# EAGLE design Nixie_v1_HV_Supply (EAGLE 9.3.0)
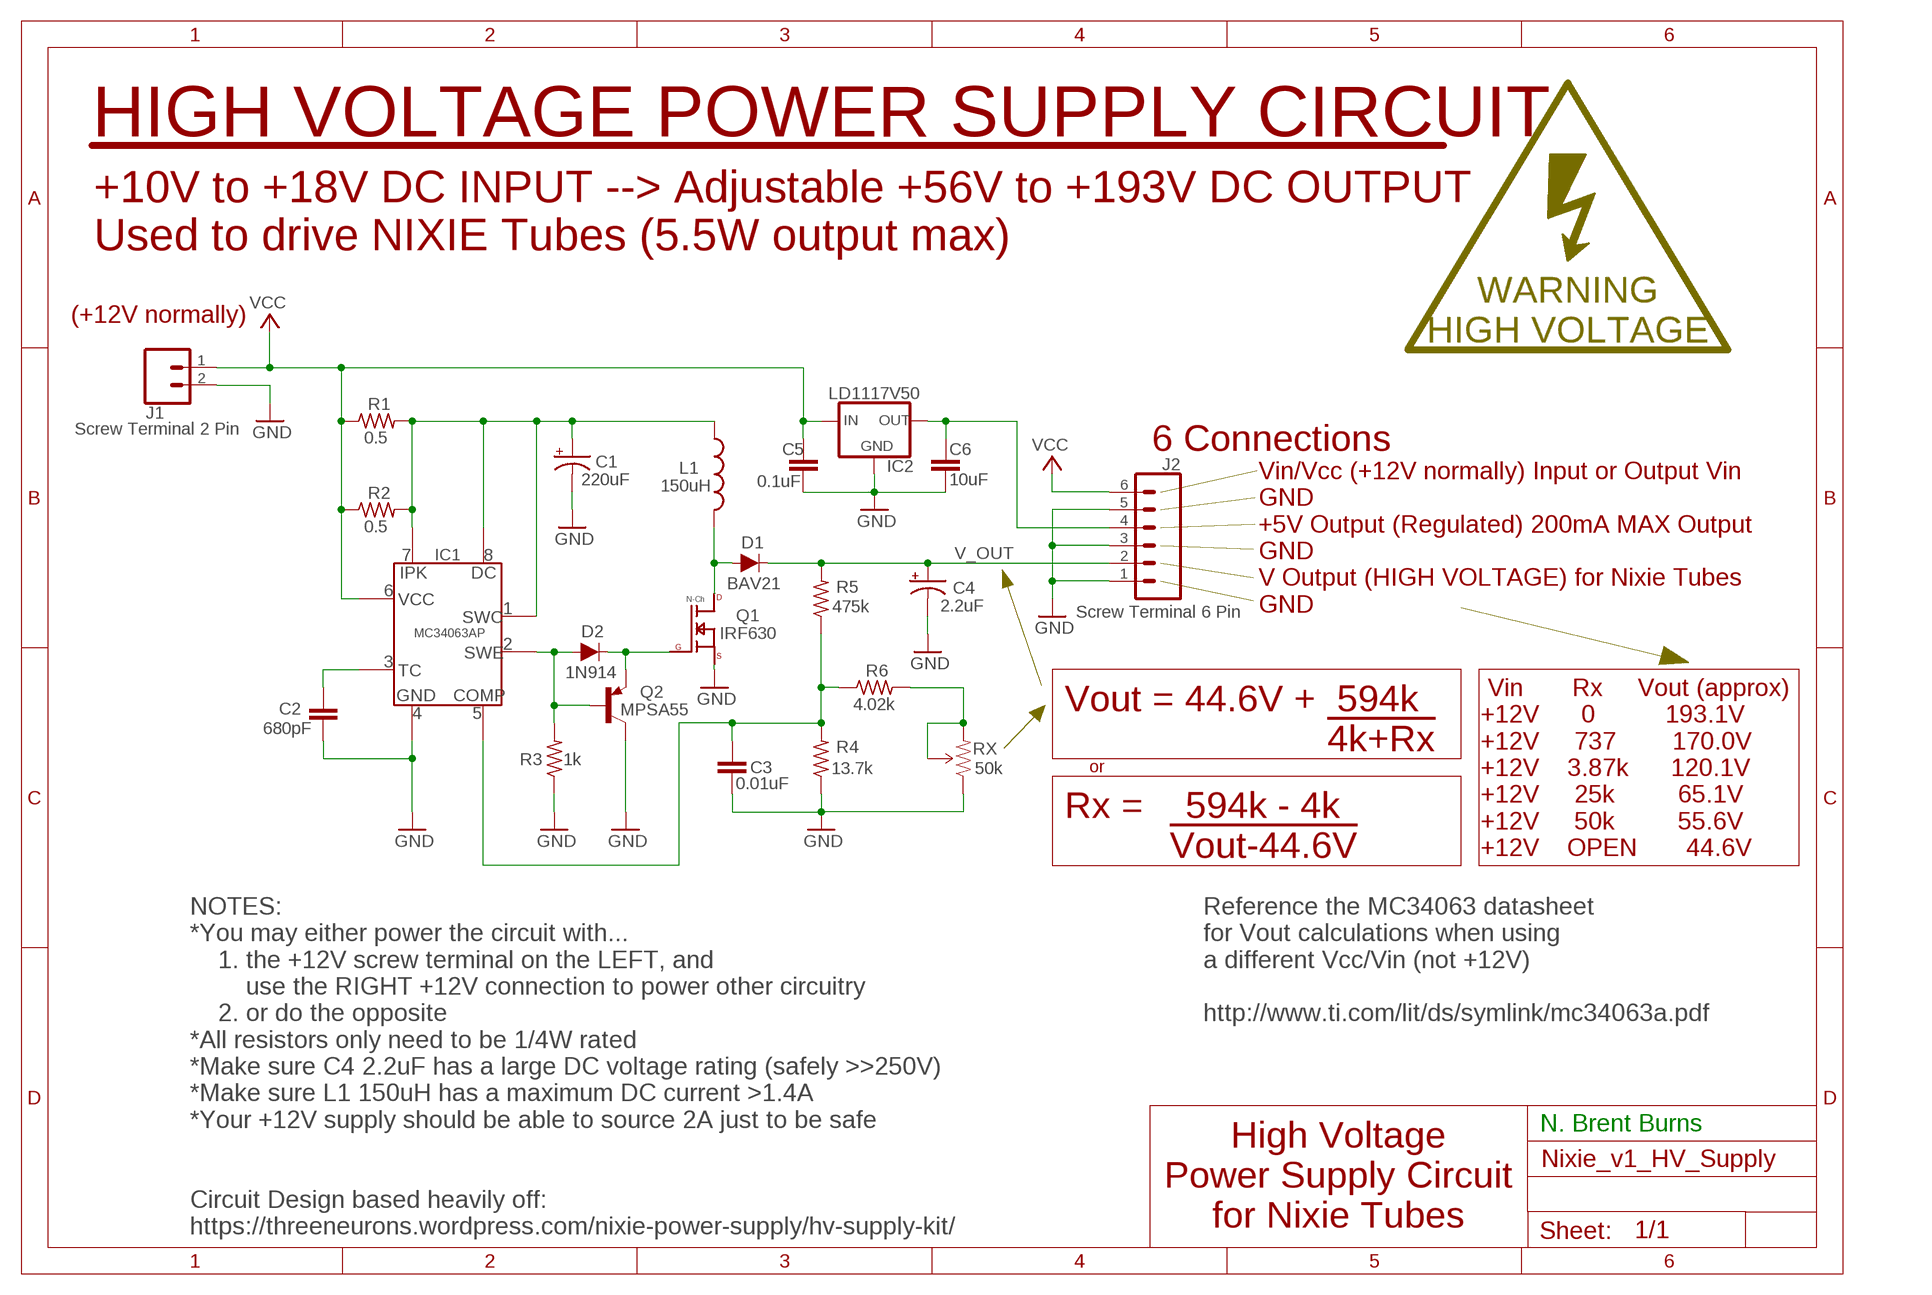
[diagram p0: schematic, sheet 1]

## Parts
C1  220uF  1000UF-RADIAL-5MM-25V-20%  [CPOL-RADIAL-5MM-10MM]
C2  680pF  C2.5/2  [C2.5-2]
C3  0.01uF  C2.5/2  [C2.5-2]
C4  2.2uF  100UF-POLAR-RADIAL-2.5MM-25V-20%  [CPOL-RADIAL-2.5MM-6.5MM]
C5  0.1uF  C2.5/2  [C2.5-2]
C6  10uF  C2.5/2  [C2.5-2]
D1  BAV21  DIODE-1N4148  [DIODE-1N4148]
D2  1N914  DIODE-1N4148  [DIODE-1N4148]
IC1  MC34063AP  [DIP08]
IC2  LD1117V50  V_REG_LD1117V50  [TO220V]
J1  Screw Terminal 2 Pin  CONNECTOR_2PINSCREW_TERMINAL_5MMPITCH_1X2  [SCREW_TERM_5MM_1X2]
J2  Screw Terminal 6 Pin  CONNECTOR_6PINSCREW_TERMINAL_5MM_PITCH  [SCREW_TERM_5MM_1X6]
L1  150uH  INDUCTOR_150UH_6100-151K-RC  [INDUCTOR_11MM_DIAM_6MM_PITCH]
Q1  IRF630  [TO220V]
Q2  MPSA55  [TO92-]
R1  0.5  R-US_0204/7  [0204/7]
R2  0.5  R-US_0204/7  [0204/7]
R3  1k  R-US_0204/7  [0204/7]
R4  13.7k  R-US_0204/7  [0204/7]
R5  475k  R-US_0204/7  [0204/7]
R6  4.02k  R-US_0204/7  [0204/7]
RX  50k  TRIMPOT  [TRIM_POT_PTH]

## Nets
GND: C1.- C2.2 C3.2 C4.2(-) C5.2 C6.2 IC1.4(GND) IC2.1(GND) J1.2 J2.1 J2.3 J2.5 Q1.3(SOURCE) Q2.3(C) R3.1 R4.1 RX.1(CCW)
N$1: C6.1 IC2.2(OUT) J2.4
N$2: D1.A L1.2 Q1.2(DRAIN)
N$3: C4.1(+) D1.C J2.2 R5.2
N$4: C2.1 IC1.3(TC)
N$5: C3.1 IC1.5(COMP) R4.2 R5.1 R6.1
N$6: C1.+ IC1.1(SWC) IC1.7(IPK) IC1.8(DC) L1.1 R1.2 R2.2
N$7: R6.2 RX.2(WIPER) RX.3(CW)
N$8: D2.A IC1.2(SWE) Q2.2(B) R3.2
N$9: D2.C Q1.1(GATE) Q2.1(E)
VCC: C5.1 IC1.6(VCC) IC2.3(IN) J1.1 J2.6 R1.1 R2.1

## Notes on the sheet
- HIGH VOLTAGE POWER SUPPLY CIRCUIT
- +10V to +18V DC INPUT --> Adjustable +56V to +193V DC OUTPUT
  Used to drive NIXIE Tubes (5.5W output max)
- (+12V normally)
- 6 Connections
- V_OUT
- Vin/Vcc (+12V normally) Input or Output Vin
  GND
  +5V Output (Regulated) 200mA MAX Output
  GND
  V Output (HIGH VOLTAGE) for Nixie Tubes
  GND
- Vout = 44.6V +  594k
                           !4k+Rx!
- or
- Vin       Rx     Vout (approx)
  +12V      0          193.1V 
  +12V     737        170.0V
  +12V    3.87k      120.1V
  +12V     25k         65.1V
  +12V     50k         55.6V
  +12V    OPEN       44.6V
- Rx =    594k - 4k
            !Vout-44.6V!
- Reference the MC34063 datasheet
  for Vout calculations when using 
  a different Vcc/Vin (not +12V)
  
  http://www.ti.com/lit/ds/symlink/mc34063a.pdf
- NOTES:
  *You may either power the circuit with...
      1. the +12V screw terminal on the LEFT, and 
          use the RIGHT +12V connection to power other circuitry
      2. or do the opposite
  *All resistors only need to be 1/4W rated
  *Make sure C4 2.2uF has a large DC voltage rating (safely >>250V)
  *Make sure L1 150uH has a maximum DC current >1.4A
  *Your +12V supply should be able to source 2A just to be safe
- N. Brent Burns
- High Voltage
  Power Supply Circuit
  for Nixie Tubes
- Circuit Design based heavily off:
  https://threeneurons.wordpress.com/nixie-power-supply/hv-supply-kit/

## Library data of the parts
C1 = SparkFun-Capacitors:1000UF: 1,000µF/1mF ceramic capacitors A capacitor is a passive two-terminal electrical component used to store electrical energy temporarily in an electric field. CAP-08070; PROD_ID: CAP-09538; VALUE: 1mF
C2 C3 C5 C6 = capacitor-wima:C: CAPACITOR naming: grid - package width
C4 = SparkFun-Capacitors:100UF-POLAR: 100µF polarized capacitors A capacitor is a passive two-terminal electrical component used to store electrical energy temporarily in an electric field.; PROD_ID: CAP-08439; VALUE: 100uF
D1 D2 = SparkFun-DiscreteSemi:DIODE: Diode These are standard reverse protection diodes and small signal diodes. SparkFun Products: SparkFun SparkPunk Sound Kit <https://www.sparkfun.com/products/11177> SparkFun ESP8266 Thing <https://www.sparkfun.com/products/13231>; PROD_ID: DIO-08378; VALUE: 200mA/100V/1V
IC1 = Brent:MC34063AP
IC2 = Brent:V_REG_LD1117V50
J1 = Brent:CONNECTOR_2PIN
J2 = Brent:CONNECTOR_6PIN
L1 = Brent:INDUCTOR_150UH_6100-151K-RC
Q1 = Brent:IRF630
Q2 = Brent:MPSA55
R1-R6 = rcl:R-US_: RESISTOR, American symbol; SPICEPREFIX: R
RX = Brent:TRIMPOT

## Board
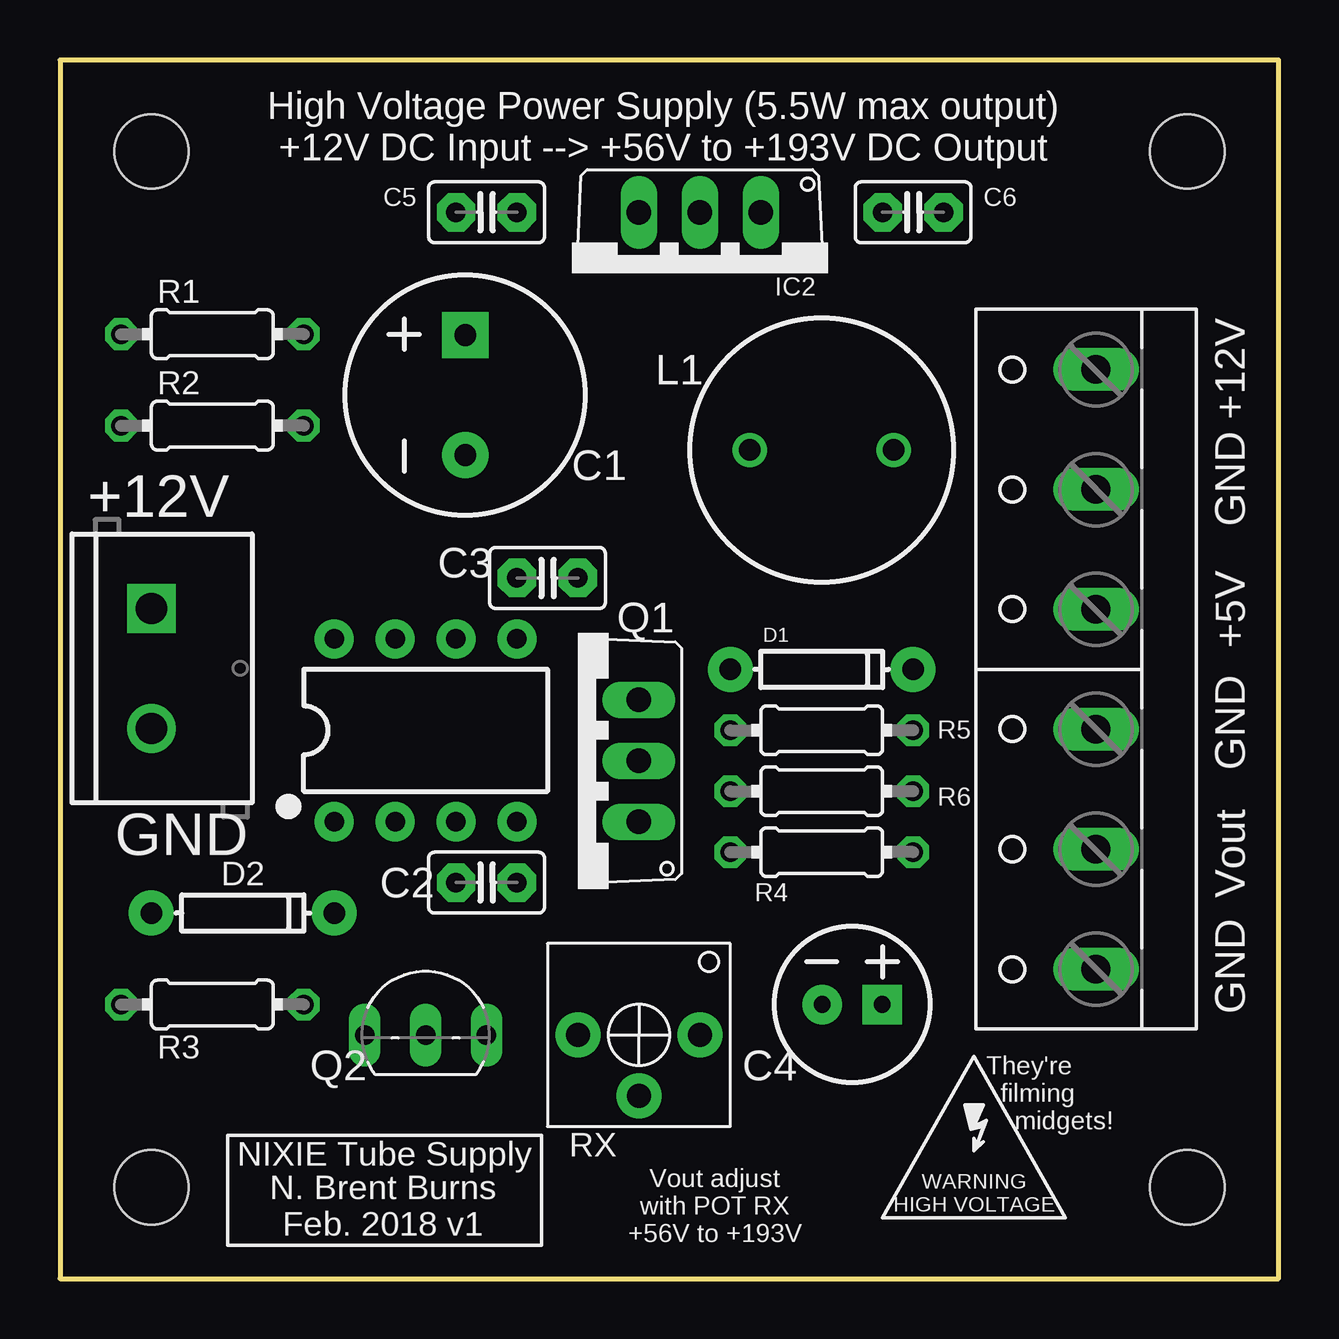
[diagram p1: board, top side]
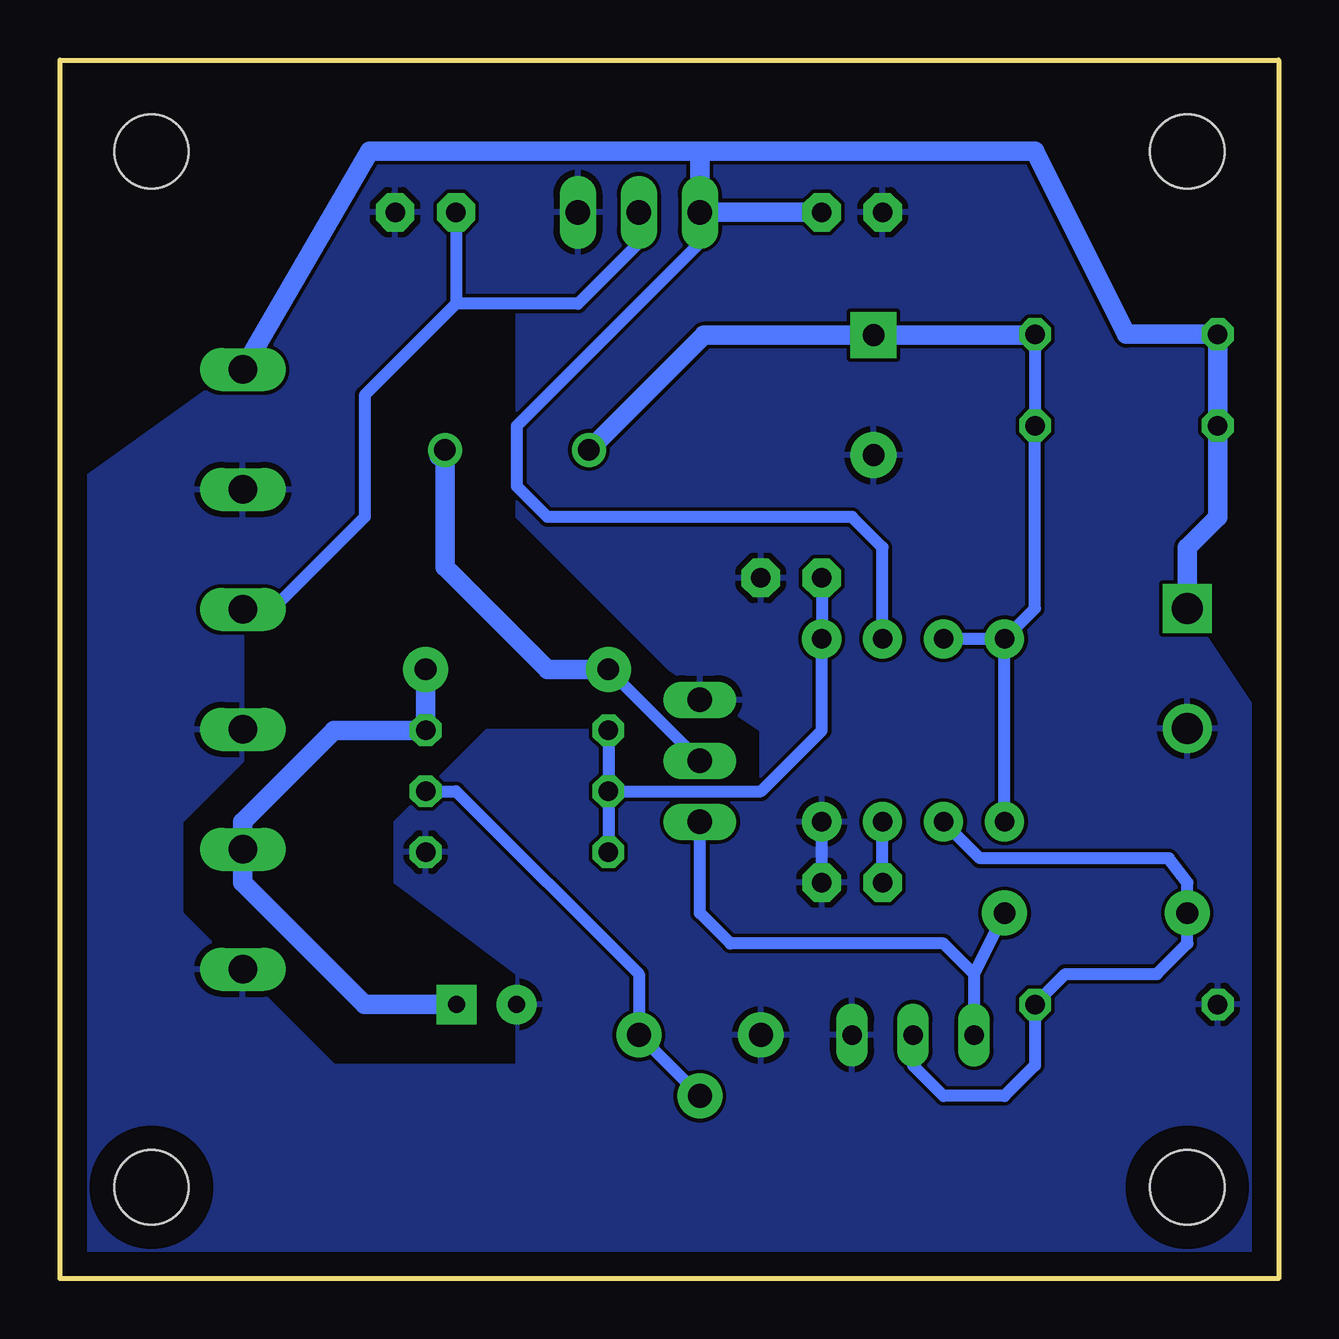
[diagram p2: board, bottom side, seen from below]

Size 50.8 x 50.8 mm. Coordinates in mm from the lower left corner, seen from the top.
Outline: 0,0 50.8,0 50.8,50.8 0,50.8 0,0
Copper layers 16: Bottom 0.035mm
Design rules "default *": minimum track width 6mil, minimum drill 0.35mm, track to track 6mil, track to pad 6mil, pad to pad 6mil, via to via 6mil, smd to smd 6mil, copper to edge 40mil, drill to drill 6mil, minimum pad ring 10mil, minimum via ring 8mil, stop-mask expansion 4mil, vias tented up to drill 0mil, thermal gap 10mil
Holes 3.1 mm at 3.81,3.81 46.99,3.81 46.99,46.99 3.81,46.99

### Footprints (pad centres in the part's own frame; a part is rotated, then mirrored left to right if it is on the bottom)
CPOL-RADIAL-5MM-10MM = drill 0.9 pad 1.93 square: + 2.5,0 | drill 0.9 pad 1.93: - -2.5,0
C2.5-2 = drill 0.813 pad 1.6 octagon: 1 -1.27,0; 2 1.27,0
CPOL-RADIAL-2.5MM-6.5MM = drill 0.7 pad 1.651 square: 1 1.25,0 | drill 0.7 pad 1.651: 2 -1.25,0
DIODE-1N4148 = drill 0.9 pad 1.88: A -3.81,0; C 3.81,0
DIP08 = drill 0.813 pad 1.626: 1 -3.81,-3.81; 2 -1.27,-3.81; 3 1.27,-3.81; 4 3.81,-3.81; 5 3.81,3.81; 6 1.27,3.81; 7 -1.27,3.81; 8 -3.81,3.81
TO220V = drill 1.016 long: 1 -2.54,-2.54; 2 0,-2.54; 3 2.54,-2.54
SCREW_TERM_5MM_1X2 = drill 1.3 pad 2.032 square: 1 0,0 | drill 1.3 pad 2.032: 2 5,0
SCREW_TERM_5MM_1X6 = drill 1.194 long: 1 -12.5,-1.27; 2 -7.5,-1.27; 3 -2.5,-1.27; 4 2.5,-1.27; 5 7.5,-1.27; 6 12.5,-1.27
INDUCTOR_11MM_DIAM_6MM_PITCH = drill 0.9 pad 1.422: 1 -3,0; 2 3,0
TO92- = drill 0.813 long: 1 -2.54,0; 2 0,0; 3 2.54,0
0204/7 = drill 0.813 octagon: 1 -3.81,0; 2 3.81,0
TRIM_POT_PTH = drill 1 pad 1.88: 1 -2.54,0; 2 0,-2.54; 3 2.54,0

### Placement (x,y rotation side)
C1  16.89,36.83 90 top
C2  17.78,16.51 0 top
C3  20.32,29.21 0 top
C4  33.02,11.43 0 top
C5  17.78,44.45 180 top
C6  35.56,44.45 0 top
D1  31.75,25.4 0 top
D2  7.62,15.24 0 top
IC1  15.24,22.86 0 top
IC2  26.67,41.91 180 top
J1  3.81,27.94 270 top
J2  41.91,25.4 90 top
L1  31.75,34.54 0 top
Q1  21.59,21.59 90 top
Q2  15.24,10.16 0 top
R1  6.35,39.37 0 top
R2  6.35,35.56 0 top
R3  6.35,11.43 0 top
R4  31.75,17.78 180 top
R5  31.75,22.86 0 top
R6  31.75,20.32 0 top
RX  24.13,10.16 0 top

### Tracks (layer width: path | path; a pad name or v marks a point on that pad's centre or on a via)
GND
  Bottom 0.508: C2.2 IC1.4
  pour Bottom: -1.27,-1.27 31.75,-1.27 31.75,12.7 36.83,16.51 36.83,19.05 33.02,22.86 27.94,22.86 27.94,20.32 21.59,20.32 21.59,22.86 25.4,25.4 31.75,31.75 31.75,46.99 10.16,46.99 6.35,39.37 2.54,39.37 2.54,31.75 3.81,30.48 3.81,27.94 -1.27,20.32
  pour Bottom: 29.21,-1.27 29.21,8.89 39.37,8.89 45.72,15.24 45.72,19.05 43.18,21.59 43.18,27.94 41.91,27.94 38.1,31.75 38.1,36.83 34.29,40.64 29.21,40.64 26.67,43.18 26.67,46.99 38.1,46.99 43.18,38.1 52.07,31.75 52.07,-1.27
N$1
  Bottom 0.508: IC2.2 26.67,43.18 29.21,40.64 34.29,40.64 | J2.4 41.95,27.9 38.1,31.75 38.1,36.83 34.29,40.64 | C6.1 34.29,40.64
N$2
  Bottom 0.508: D1.A Q1.2
  Bottom 0.813: 35,34.29 L1.2 34.75,29.67 30.48,25.4 D1.A
N$3
  Bottom 0.813: D1.C R5.2 39.37,22.86 43.18,19.05 J2.2 43.18,16.51 38.1,11.43 C4.1
N$4
  Bottom 0.508: C2.1 IC1.3
N$5
  Bottom 0.508: R5.1 R6.1 | R6.1 R4.2 | C3.1 IC1.5 19.05,22.86 21.59,20.32 R6.1
N$6
  Bottom 0.508: 10.2,39.33 R1.2 R2.2 10.16,27.94 IC1.8 | IC1.8 IC1.7 | IC1.1 IC1.8
  Bottom 0.813: 10.2,39.33 C1.+ 23.96,39.33 L1.1
N$7
  Bottom 0.508: R6.2 34.29,20.32 26.67,12.7 RX.3 RX.2
N$8
  Bottom 0.508: Q2.2 15.24,8.89 13.97,7.62 11.43,7.62 10.16,8.89 R3.2 8.89,12.7 5.08,12.7 3.81,13.97 D2.A 3.81,16.51 4.57,17.53 12.45,17.53 IC1.2
N$9
  Bottom 0.508: D2.C 12.7,12.7 | 12.7,12.7 Q2.1 | 12.7,12.7 13.97,13.97 22.86,13.97 24.13,15.24 Q1.1
VCC
  Bottom 0.508: IC1.6 16.51,30.48 17.78,31.75 30.48,31.75 31.75,33.02 31.75,35.56 24.13,43.18 IC2.3
  Bottom 0.813: J1.1 3.81,30.48 2.54,31.75 R2.1 R1.1 6.35,39.37 10.16,46.99 24.13,46.99 | 24.13,46.99 37.9,46.99 J2.6 | 24.13,46.99 IC2.3 C5.1

### Text on the board
tPlace: High Voltage Power Supply (5.5W max output) / +12V DC Input --> +56V to +193V DC Output | +12V | +12V | GND | +5V | GND | GND | Vout | GND | They're / filming / midgets! | NIXIE Tube Supply | WARNING / HIGH VOLTAGE | N. Brent Burns / Feb. 2018 v1 | Vout adjust / with POT RX / +56V to +193V
Document: Pin header spacing (for breadboard) / either 1.60 in or 2.3 in